# EAGLE schematic DESIGN9BM (EAGLE 9.6.2)
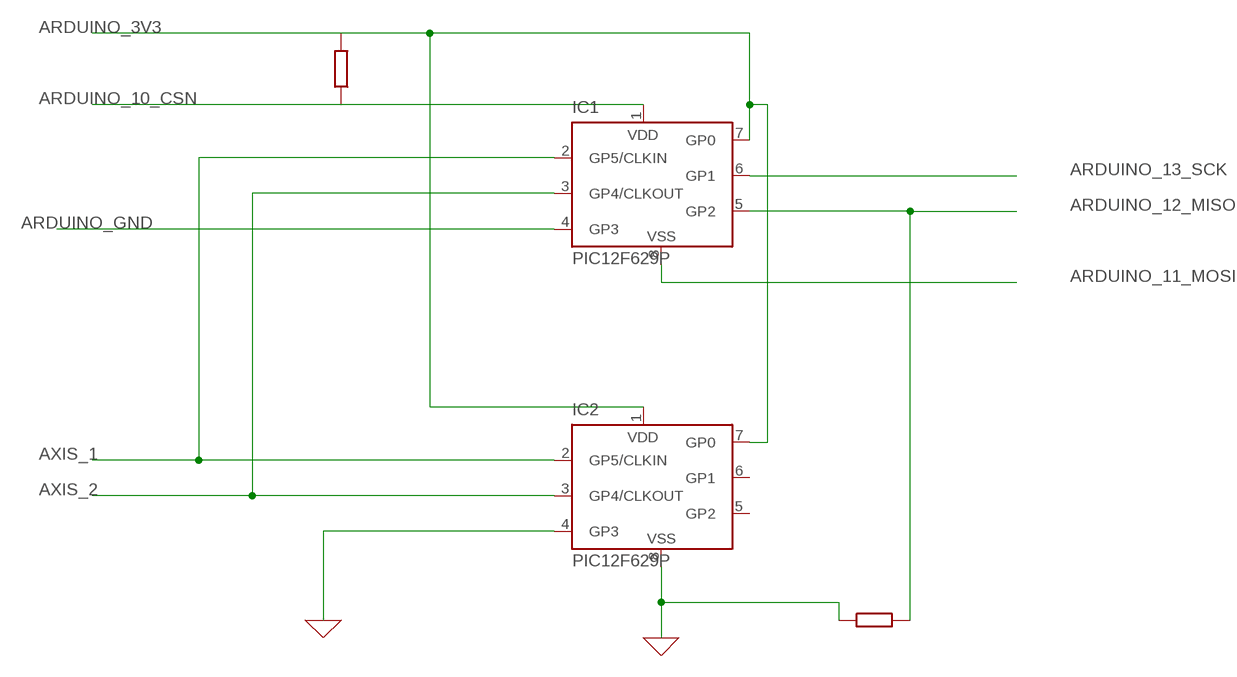
[diagram p0: schematic, sheet 1]

## Parts
IC1  PIC12F629P  [DIL8]
IC2  PIC12F629P  [DIL8]

## Nets
0: IC2.8(VSS) ; supply symbol labelled GND
ARDUINO_3V3: IC1.7(GP0) IC2.1(VDD) IC2.7(GP0)
ARDUINO_10_CSN: IC1.1(VDD)
ARDUINO_11_MOSI: IC1.8(VSS)
ARDUINO_12_MISO: IC1.5(GP2)
ARDUINO_13_SCK: IC1.6(GP1)
ARDUINO_GND: IC1.4(GP3)
AXIS_1: IC1.2(GP5/CLKIN) IC2.2(GP5/CLKIN)
AXIS_2: IC1.3(GP4/CLKOUT) IC2.3(GP4/CLKOUT)
N$1: IC2.4(GP3) ; supply symbol labelled GND
Unconnected: IC2.5(GP2) IC2.6(GP1)

## Library data of the parts
IC1 IC2 = microchip:PIC12F6*: Data Sheet 8-Pin FLASH-Based 8-Bit CMOS Microcontrollers Source: http://www.microchip.com .. 41190c.pdf; MF: MICROCHIP; MPN: PIC12F629-I/P; OC_FARNELL: 1292253; OC_NEWARK: 67K0822